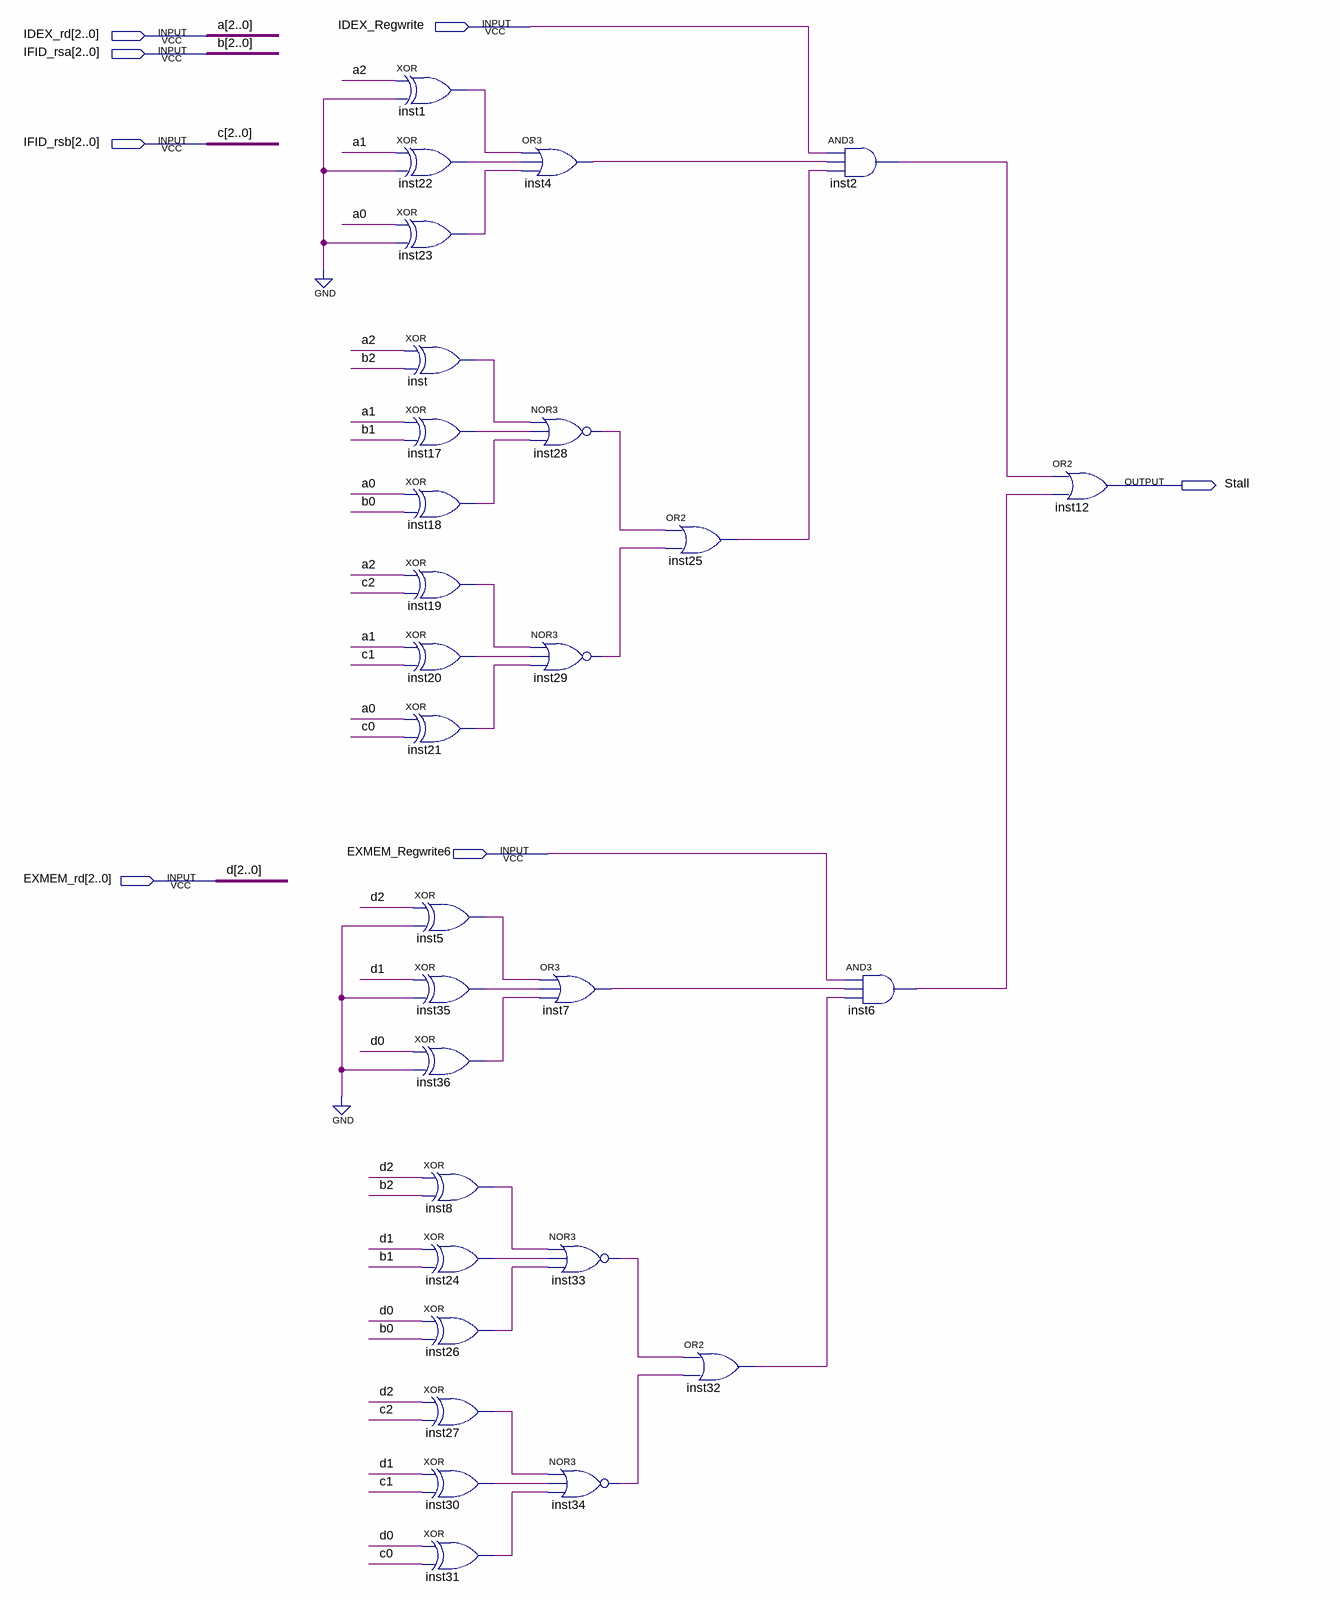
[diagram p0: schematic sheet]
// Quartus schematic Stall.bdf as structural Verilog: 29 symbols, 7 pins
module Stall (
  input  IDEX_Regwrite,
  input  [2:0] IDEX_rd,
  input  [2:0] IFID_rsa,
  input  [2:0] IFID_rsb,
  input  EXMEM_Regwrite6,
  input  [2:0] EXMEM_rd,
  output Stall
);

  wire inst1_out, inst2_out, inst4_out, inst5_out, inst6_out, inst7_out, inst8_out, inst17_out, inst18_out,
       inst19_out, inst20_out, inst21_out, inst22_out, inst23_out, inst24_out, inst25_out, inst26_out,
       inst27_out, inst28_out, inst29_out, inst30_out, inst31_out, inst32_out, inst33_out, inst34_out,
       inst35_out, inst36_out, inst_out;

  xor inst1 (inst1_out, IDEX_rd[2], 1'b0);
  xor inst22 (inst22_out, IDEX_rd[1], 1'b0);
  xor inst23 (inst23_out, IDEX_rd[0], 1'b0);
  xor inst (inst_out, IDEX_rd[2], IFID_rsa[2]);
  xor inst17 (inst17_out, IDEX_rd[1], IFID_rsa[1]);
  xor inst18 (inst18_out, IDEX_rd[0], IFID_rsa[0]);
  xor inst19 (inst19_out, IDEX_rd[2], IFID_rsb[2]);
  xor inst20 (inst20_out, IDEX_rd[1], IFID_rsb[1]);
  xor inst21 (inst21_out, IDEX_rd[0], IFID_rsb[0]);
  xor inst5 (inst5_out, EXMEM_rd[2], 1'b0);
  xor inst35 (inst35_out, EXMEM_rd[1], 1'b0);
  xor inst36 (inst36_out, EXMEM_rd[0], 1'b0);
  xor inst8 (inst8_out, EXMEM_rd[2], IFID_rsa[2]);
  xor inst24 (inst24_out, EXMEM_rd[1], IFID_rsa[1]);
  xor inst26 (inst26_out, EXMEM_rd[0], IFID_rsa[0]);
  xor inst27 (inst27_out, EXMEM_rd[2], IFID_rsb[2]);
  xor inst30 (inst30_out, EXMEM_rd[1], IFID_rsb[1]);
  xor inst31 (inst31_out, EXMEM_rd[0], IFID_rsb[0]);
  or inst4 (inst4_out, inst1_out, inst22_out, inst23_out);
  nor inst28 (inst28_out, inst_out, inst17_out, inst18_out);
  nor inst29 (inst29_out, inst19_out, inst20_out, inst21_out);
  or inst7 (inst7_out, inst5_out, inst35_out, inst36_out);
  nor inst33 (inst33_out, inst8_out, inst24_out, inst26_out);
  nor inst34 (inst34_out, inst27_out, inst30_out, inst31_out);
  or inst25 (inst25_out, inst28_out, inst29_out);
  or inst32 (inst32_out, inst33_out, inst34_out);
  and inst2 (inst2_out, IDEX_Regwrite, inst4_out, inst25_out);
  and inst6 (inst6_out, EXMEM_Regwrite6, inst7_out, inst32_out);
  or inst12 (Stall, inst2_out, inst6_out);

  // Other names for the same wires on the sheet: a[2:0] = IDEX_rd; a0 = IDEX_rd[0]; a1 = IDEX_rd[1]; a2 = IDEX_rd[2];
  //   b[2:0] = IFID_rsa; b0 = IFID_rsa[0]; b1 = IFID_rsa[1]; b2 = IFID_rsa[2]; c[2:0] = IFID_rsb; c0 = IFID_rsb[0];
  //   c1 = IFID_rsb[1]; c2 = IFID_rsb[2]; d[2:0] = EXMEM_rd; d0 = EXMEM_rd[0]; d1 = EXMEM_rd[1]; d2 = EXMEM_rd[2]
endmodule
